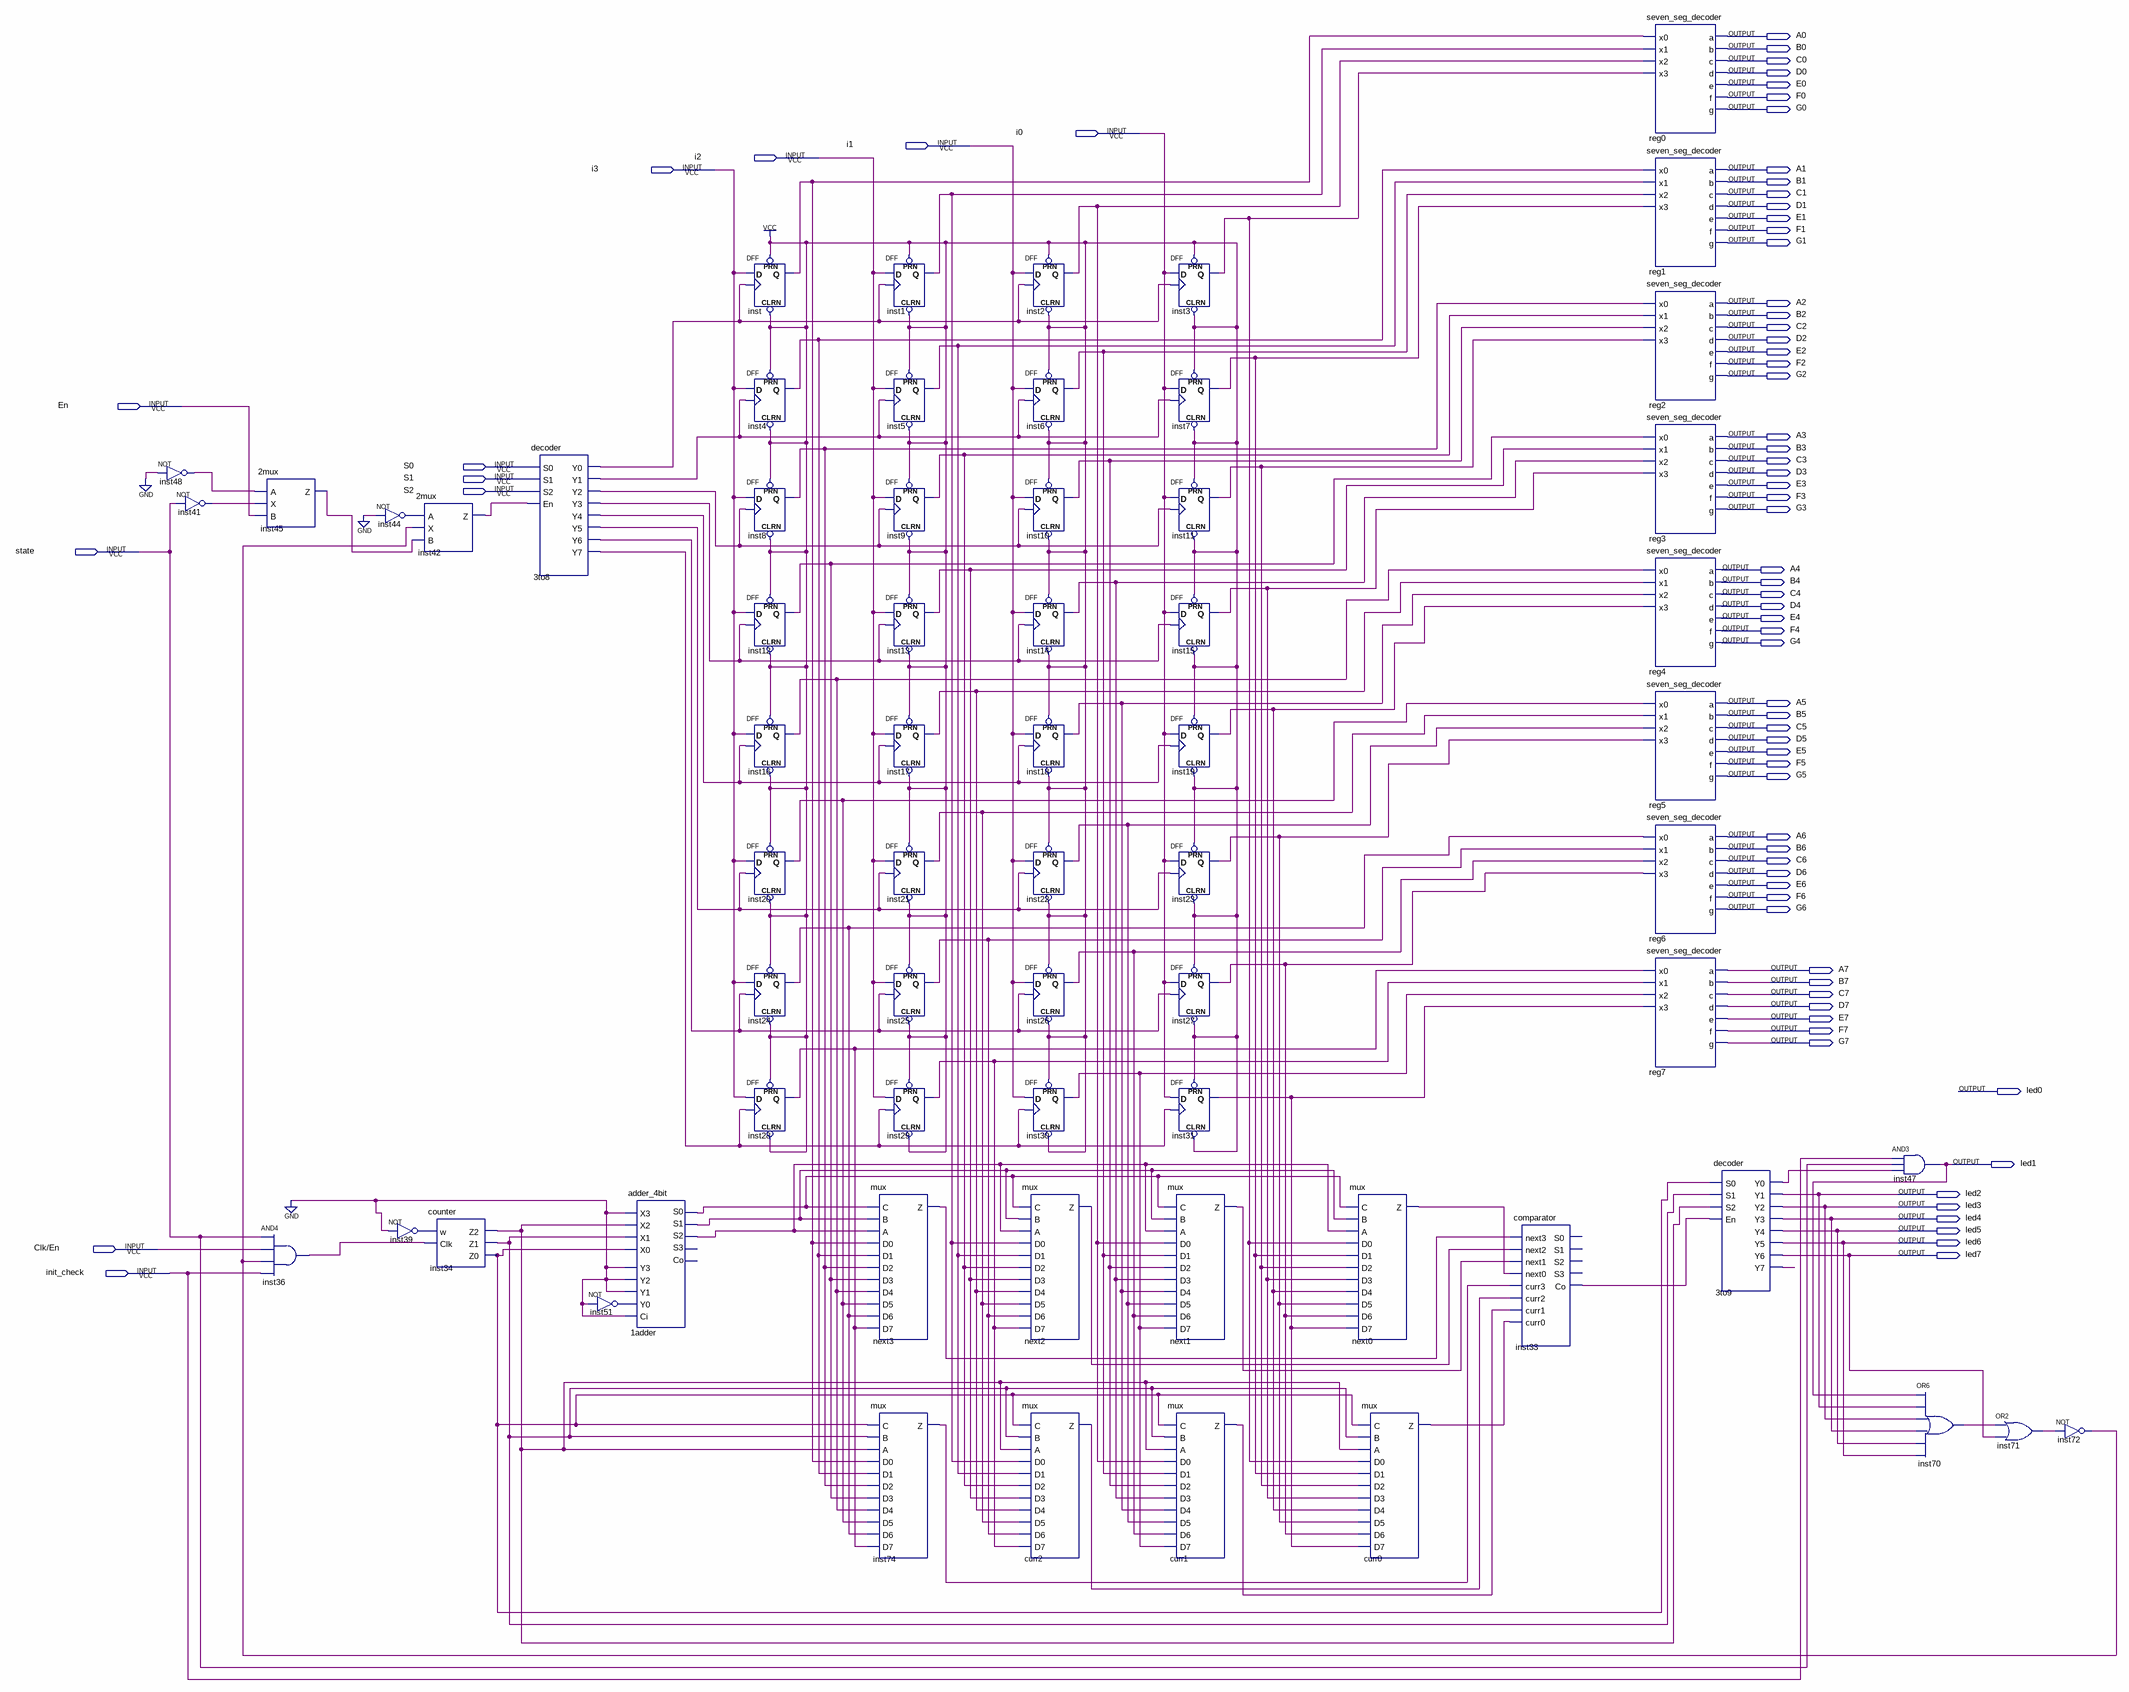
[diagram p0: schematic sheet]
// Quartus schematic register.bdf as structural Verilog: 65 symbols, 75 pins
module register (
  input  i0,
  input  i1,
  input  i2,
  input  i3,
  input  En,
  input  S0,
  input  S1,
  input  S2,
  input  state,
  input  \Clk/En ,
  input  init_check,
  output A0,
  output B0,
  output C0,
  output D0,
  output E0,
  output F0,
  output G0,
  output A1,
  output B1,
  output C1,
  output D1,
  output E1,
  output F1,
  output G1,
  output A2,
  output B2,
  output C2,
  output D2,
  output E2,
  output F2,
  output G2,
  output A3,
  output B3,
  output C3,
  output D3,
  output E3,
  output F3,
  output G3,
  output A4,
  output B4,
  output C4,
  output D4,
  output E4,
  output F4,
  output G4,
  output A5,
  output B5,
  output C5,
  output D5,
  output E5,
  output F5,
  output G5,
  output A6,
  output B6,
  output C6,
  output D6,
  output E6,
  output F6,
  output G6,
  output A7,
  output B7,
  output C7,
  output D7,
  output E7,
  output F7,
  output G7,
  output led0,
  output led1,
  output led2,
  output led3,
  output led4,
  output led5,
  output led6,
  output led7
);

  wire curr0_z, curr1_z, curr2_z, inst1_q, inst2_q, inst3_q, inst4_q, inst5_q, inst6_q, inst7_q, inst8_q,
       inst9_q, inst10_q, inst11_q, inst12_q, inst13_q, inst14_q, inst15_q, inst16_q, inst17_q, inst18_q,
       inst19_q, inst20_q, inst21_q, inst22_q, inst23_q, inst24_q, inst25_q, inst26_q, inst27_q, inst28_q,
       inst29_q, inst30_q, inst31_q, inst33_co, inst34_z0, inst34_z1, inst34_z2, inst36_out, inst39_out,
       inst41_out, inst42_z, inst44_out, inst45_z, inst48_out, inst51_out, inst70_out, inst71_out,
       inst72_out, inst74_z, inst_q, n1adder_s0, n1adder_s1, n1adder_s2, n3to8_y0, n3to8_y1, n3to8_y2,
       n3to8_y3, n3to8_y4, n3to8_y5, n3to8_y6, n3to8_y7, n3to9_y0, n3to9_y7, next0_z, next1_z, next2_z,
       next3_z;

  not inst48 (inst48_out, 1'b0);
  not inst41 (inst41_out, state);
  \2mux  inst45 (.A(inst48_out), .X(inst41_out), .B(En), .Z(inst45_z));
  and inst36 (inst36_out, state, \Clk/En , inst72_out, init_check);
  not inst44 (inst44_out, 1'b0);
  not inst39 (inst39_out, 1'b0);
  \2mux  inst42 (.A(inst44_out), .X(inst72_out), .B(inst45_z), .Z(inst42_z));
  counter inst34 (.w(inst39_out), .Clk(inst36_out), .Z2(inst34_z2), .Z1(inst34_z1), .Z0(inst34_z0));
  decoder u_3to8 (
    .S0(S0), .S1(S1), .S2(S2), .En(inst42_z), .Y0(n3to8_y0), .Y1(n3to8_y1), .Y2(n3to8_y2), .Y3(n3to8_y3),
    .Y4(n3to8_y4), .Y5(n3to8_y5), .Y6(n3to8_y6), .Y7(n3to8_y7));
  not inst51 (inst51_out, 1'b0);
  adder_4bit u_1adder (
    .X3(1'b0), .Y3(1'b0), .X2(inst34_z2), .Y2(1'b0), .X1(inst34_z1), .Y1(1'b0), .X0(inst34_z0),
    .Y0(inst51_out), .Ci(1'b0), .S0(n1adder_s0), .S1(n1adder_s1), .S2(n1adder_s2));  // open: S3, Co
  DFF inst (.CLRN(1'b1), .CLK(n3to8_y0), .D(i3), .PRN(1'b1), .Q(inst_q));
  DFF inst4 (.CLRN(1'b1), .CLK(n3to8_y1), .D(i3), .PRN(1'b1), .Q(inst4_q));
  DFF inst8 (.CLRN(1'b1), .CLK(n3to8_y2), .D(i3), .PRN(1'b1), .Q(inst8_q));
  DFF inst12 (.CLRN(1'b1), .CLK(n3to8_y3), .D(i3), .PRN(1'b1), .Q(inst12_q));
  DFF inst16 (.CLRN(1'b1), .CLK(n3to8_y4), .D(i3), .PRN(1'b1), .Q(inst16_q));
  DFF inst20 (.CLRN(1'b1), .CLK(n3to8_y5), .D(i3), .PRN(1'b1), .Q(inst20_q));
  DFF inst24 (.CLRN(1'b1), .CLK(n3to8_y6), .D(i3), .PRN(1'b1), .Q(inst24_q));
  DFF inst28 (.CLRN(1'b1), .CLK(n3to8_y7), .D(i3), .PRN(1'b1), .Q(inst28_q));
  DFF inst1 (.CLRN(1'b1), .CLK(n3to8_y0), .D(i2), .PRN(1'b1), .Q(inst1_q));
  DFF inst5 (.CLRN(1'b1), .CLK(n3to8_y1), .D(i2), .PRN(1'b1), .Q(inst5_q));
  DFF inst9 (.CLRN(1'b1), .CLK(n3to8_y2), .D(i2), .PRN(1'b1), .Q(inst9_q));
  DFF inst13 (.CLRN(1'b1), .CLK(n3to8_y3), .D(i2), .PRN(1'b1), .Q(inst13_q));
  DFF inst17 (.CLRN(1'b1), .CLK(n3to8_y4), .D(i2), .PRN(1'b1), .Q(inst17_q));
  DFF inst21 (.CLRN(1'b1), .CLK(n3to8_y5), .D(i2), .PRN(1'b1), .Q(inst21_q));
  DFF inst25 (.CLRN(1'b1), .CLK(n3to8_y6), .D(i2), .PRN(1'b1), .Q(inst25_q));
  DFF inst29 (.CLRN(1'b1), .CLK(n3to8_y7), .D(i2), .PRN(1'b1), .Q(inst29_q));
  mux next3 (
    .C(n1adder_s0), .B(n1adder_s1), .A(n1adder_s2), .D0(inst_q), .D1(inst4_q), .D2(inst8_q), .D3(inst12_q),
    .D4(inst16_q), .D5(inst20_q), .D6(inst24_q), .D7(inst28_q), .Z(next3_z));
  mux inst74 (
    .C(inst34_z0), .B(inst34_z1), .A(inst34_z2), .D0(inst_q), .D1(inst4_q), .D2(inst8_q), .D3(inst12_q),
    .D4(inst16_q), .D5(inst20_q), .D6(inst24_q), .D7(inst28_q), .Z(inst74_z));
  DFF inst2 (.CLRN(1'b1), .CLK(n3to8_y0), .D(i1), .PRN(1'b1), .Q(inst2_q));
  DFF inst6 (.CLRN(1'b1), .CLK(n3to8_y1), .D(i1), .PRN(1'b1), .Q(inst6_q));
  DFF inst10 (.CLRN(1'b1), .CLK(n3to8_y2), .D(i1), .PRN(1'b1), .Q(inst10_q));
  DFF inst14 (.CLRN(1'b1), .CLK(n3to8_y3), .D(i1), .PRN(1'b1), .Q(inst14_q));
  DFF inst18 (.CLRN(1'b1), .CLK(n3to8_y4), .D(i1), .PRN(1'b1), .Q(inst18_q));
  DFF inst22 (.CLRN(1'b1), .CLK(n3to8_y5), .D(i1), .PRN(1'b1), .Q(inst22_q));
  DFF inst26 (.CLRN(1'b1), .CLK(n3to8_y6), .D(i1), .PRN(1'b1), .Q(inst26_q));
  DFF inst30 (.CLRN(1'b1), .CLK(n3to8_y7), .D(i1), .PRN(1'b1), .Q(inst30_q));
  mux next2 (
    .C(n1adder_s0), .B(n1adder_s1), .A(n1adder_s2), .D0(inst1_q), .D1(inst5_q), .D2(inst9_q), .D3(inst13_q),
    .D4(inst17_q), .D5(inst21_q), .D6(inst25_q), .D7(inst29_q), .Z(next2_z));
  mux curr2 (
    .C(inst34_z0), .B(inst34_z1), .A(inst34_z2), .D0(inst1_q), .D1(inst5_q), .D2(inst9_q), .D3(inst13_q),
    .D4(inst17_q), .D5(inst21_q), .D6(inst25_q), .D7(inst29_q), .Z(curr2_z));
  DFF inst3 (.CLRN(1'b1), .CLK(n3to8_y0), .D(i0), .PRN(1'b1), .Q(inst3_q));
  DFF inst7 (.CLRN(1'b1), .CLK(n3to8_y1), .D(i0), .PRN(1'b1), .Q(inst7_q));
  DFF inst11 (.CLRN(1'b1), .CLK(n3to8_y2), .D(i0), .PRN(1'b1), .Q(inst11_q));
  DFF inst15 (.CLRN(1'b1), .CLK(n3to8_y3), .D(i0), .PRN(1'b1), .Q(inst15_q));
  DFF inst19 (.CLRN(1'b1), .CLK(n3to8_y4), .D(i0), .PRN(1'b1), .Q(inst19_q));
  DFF inst23 (.CLRN(1'b1), .CLK(n3to8_y5), .D(i0), .PRN(1'b1), .Q(inst23_q));
  DFF inst27 (.CLRN(1'b1), .CLK(n3to8_y6), .D(i0), .PRN(1'b1), .Q(inst27_q));
  DFF inst31 (.CLRN(1'b1), .CLK(n3to8_y7), .D(i0), .PRN(1'b1), .Q(inst31_q));
  mux next1 (
    .C(n1adder_s0), .B(n1adder_s1), .A(n1adder_s2), .D0(inst2_q), .D1(inst6_q), .D2(inst10_q), .D3(inst14_q),
    .D4(inst18_q), .D5(inst22_q), .D6(inst26_q), .D7(inst30_q), .Z(next1_z));
  mux curr1 (
    .C(inst34_z0), .B(inst34_z1), .A(inst34_z2), .D0(inst2_q), .D1(inst6_q), .D2(inst10_q), .D3(inst14_q),
    .D4(inst18_q), .D5(inst22_q), .D6(inst26_q), .D7(inst30_q), .Z(curr1_z));
  mux next0 (
    .C(n1adder_s0), .B(n1adder_s1), .A(n1adder_s2), .D0(inst3_q), .D1(inst7_q), .D2(inst11_q), .D3(inst15_q),
    .D4(inst19_q), .D5(inst23_q), .D6(inst27_q), .D7(inst31_q), .Z(next0_z));
  mux curr0 (
    .C(inst34_z0), .B(inst34_z1), .A(inst34_z2), .D0(inst3_q), .D1(inst7_q), .D2(inst11_q), .D3(inst15_q),
    .D4(inst19_q), .D5(inst23_q), .D6(inst27_q), .D7(inst31_q), .Z(curr0_z));
  comparator inst33 (
    .next3(next3_z), .next2(next2_z), .next1(next1_z), .next0(next0_z), .curr3(inst74_z), .curr2(curr2_z),
    .curr1(curr1_z), .curr0(curr0_z), .Co(inst33_co));  // open: S0, S1, S2, S3
  seven_seg_decoder reg0 (
    .x0(inst_q), .x1(inst1_q), .x2(inst2_q), .x3(inst3_q), .a(A0), .b(B0), .c(C0), .d(D0), .e(E0), .f(F0),
    .g(G0));
  seven_seg_decoder reg1 (
    .x0(inst4_q), .x1(inst5_q), .x2(inst6_q), .x3(inst7_q), .a(A1), .b(B1), .c(C1), .d(D1), .e(E1), .f(F1),
    .g(G1));
  seven_seg_decoder reg2 (
    .x0(inst8_q), .x1(inst9_q), .x2(inst10_q), .x3(inst11_q), .a(A2), .b(B2), .c(C2), .d(D2), .e(E2), .f(F2),
    .g(G2));
  seven_seg_decoder reg3 (
    .x0(inst12_q), .x1(inst13_q), .x2(inst14_q), .x3(inst15_q), .a(A3), .b(B3), .c(C3), .d(D3), .e(E3),
    .f(F3), .g(G3));
  seven_seg_decoder reg4 (
    .x0(inst16_q), .x1(inst17_q), .x2(inst18_q), .x3(inst19_q), .a(A4), .b(B4), .c(C4), .d(D4), .e(E4),
    .f(F4), .g(G4));
  seven_seg_decoder reg5 (
    .x0(inst20_q), .x1(inst21_q), .x2(inst22_q), .x3(inst23_q), .a(A5), .b(B5), .c(C5), .d(D5), .e(E5),
    .f(F5), .g(G5));
  seven_seg_decoder reg6 (
    .x0(inst24_q), .x1(inst25_q), .x2(inst26_q), .x3(inst27_q), .a(A6), .b(B6), .c(C6), .d(D6), .e(E6),
    .f(F6), .g(G6));
  seven_seg_decoder reg7 (
    .x0(inst28_q), .x1(inst29_q), .x2(inst30_q), .x3(inst31_q), .a(A7), .b(B7), .c(C7), .d(D7), .e(E7),
    .f(F7), .g(G7));
  decoder u_3to9 (
    .S0(inst34_z0), .S1(inst34_z1), .S2(inst34_z2), .En(inst33_co), .Y0(n3to9_y0), .Y1(led2), .Y2(led3),
    .Y3(led4), .Y4(led5), .Y5(led6), .Y6(led7), .Y7(n3to9_y7));
  and inst47 (led1, init_check, state, n3to9_y0);
  or inst70 (inst70_out, led1, led2, led3, led4, led5, led6);
  or inst71 (inst71_out, inst70_out, led7);
  not inst72 (inst72_out, inst71_out);
endmodule
